# Altium schematic sheet VCA.SchDoc
size A4
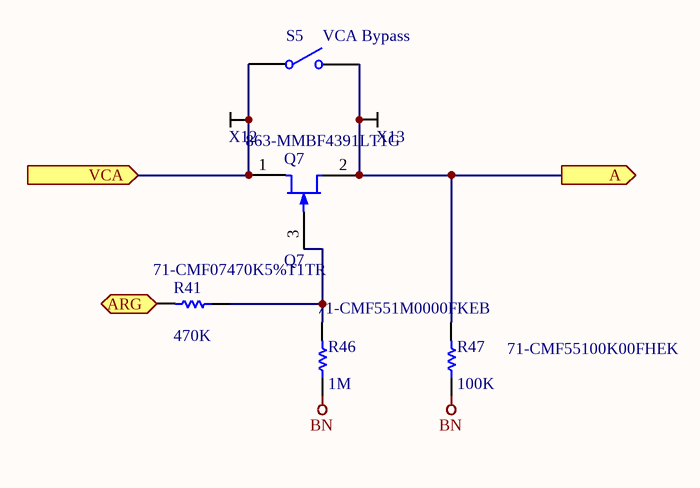
[diagram p0: VCA.SchDoc]

## Parts
Q7  Q7  Supplier Part Number 2: 863-MMBF4391LT1G  [ONSC-SOT-23-3-318-08_V]
R41  Supplier Part Number 1: 71-CMF07470K5%T1TR  [AXIAL-0.3]  (hidden comment: 470K)
R46  Supplier Part Number 1: 71-CMF551M0000FKEB  [AXIAL-0.3]  (hidden comment: 1M)
R47  Supplier Part Number 1: 71-CMF55100K00FHEK  [AXIAL-0.3]  (hidden comment: 100K)
S5  VCA Bypass  [SPST-2]
X12  X12  [Pad]  (value not drawn)
X13  X13  [Pad]  (value not drawn)

## Ports
A (out), ARG (out), VCA (in)

## Nets
BN: R46.1 R47.1
A: Q7.2(S) R47.2 S5.2(NO) X13.1 ; port A
ARG: R41.2 ; port ARG
VCA: Q7.1(D) S5.1(COMMON) X12.1 ; port VCA
NetQ7_3: Q7.3(G) R41.1 R46.2

## Library data of the parts
Q7 = MMBF4391LT1: JFET Switching Transistor, N-Channel, 3-Pin SOT-23, Tape and Reel; Manufacturer: On Semiconductor; Manufacturer Part Number: MMBF4391LT1G; Channel Polarity: N Channel; Ciss Max (pF): 14; Crss Max (pF): 3.5; IDSS Max (uA): 150000; IDSS Min (uA): 50000; V(BR)GSS Min (V): 30; Configuration: Single; Drain-Source Current at Vgs=0: 50 mA to 150 mA; Vds - Drain-Source Breakdown Voltage: 30 V; DatasheetVersion: Rev. 10; PackageVersion: Rev. AP, 11/2009; PackageReference: SOT-23-3-318-08; PackageDescription: 3-Pin Small Outline Transistor, Body 2.92 x 1.3 mm, Pitch 0.95 mm; Supplier 1: Mouser; Supplier Part Number 1: 863-MMBF4391LT1G; Packing: Tape and Reel; Mounting Technology: Surface Mount; PartNumber: MMBF4391LT1; ComponentLink1Description: Manufacturer URL; ComponentLink1URL: http://www.onsemi.com/; ComponentLink2Description: Datasheet; ComponentLink2URL: http://www.onsemi.com/pub_link/Collateral/MMBF4391LT1-D.PDF; ComponentLink3Description: Package Specification; ComponentLink3URL: http://www.onsemi.cn/pub_link/Collateral/318-08.PDF; Supplier 2: Mouser; RoHS: RoHS Compliant; Category: JFET; Stock 2: 3330; Pricing 2: 1=0.490, 10=0.339, 100=0.156, 1000=0.120, 3000=0.102, 9000=0.093, 24000=0.087, 45000=0.078, 99000=0.075 (USD); Package / Case: SOT-23-3; Packaging: Reel; Series: MMBF4391L; Brand: ON Semiconductor; Mounting Style: SMD/SMT; Transistor Polarity: N-Channel; Standard Pack Qty: 3000; Vgs - Gate-Source Breakdown Voltage: 30 V; RoHS - Mouser: Y; Minimum Order Quantity: 1; Reeling: True; ComponentLink4URL: http://www.mouser.com/ds/2/308/MMBF4391LT1-D-108578.pdf; ComponentLink4Description: http://www.mouser.com/ds/2/308/MMBF4391LT1-D-108578.pdf
R41 = Res1: Resistor; Manufacturer: Vishay / Dale; Manufacturer Part Number: CMF07470K00JKR6; Power Rating: 500 mW (1/2 W); Resistance: 470 kOhms; Temperature Coefficient: 100 PPM / C; Tolerance: 5 %; Voltage Rating: 250 V; Lead Diameter: 0.64 mm; Published: 8-Jun-2000; LatestRevisionDate: 17-Jul-2002; LatestRevisionNote: Re-released for DXP Platform.; PackageReference: AXIAL-0.3; Publisher: Altium Limited; PackageDescription: Axial Device, Thru-Hole; 2 Leads; 0.3 in Pin Spacing; Value: 470K; Supplier 1: Mouser; RoHS: No; Category: Metal Film Resistors - Through Hole; Stock 1: 1018; Pricing 1: 1=0.160, 1000=0.160, 2000=0.085, 4000=0.078, 10000=0.072, 20000=0.066 (USD); Diameter: 2.29 mm; Length: 6.1 mm; Operating Temperature Range: - 55 C to + 175 C; Packaging: Reel; Product: Metal Film Resistors Controlled Temp Coefficient; Series: CMF Industrial; Termination Style: Axial; Type: Metal Film Resistors, Industrial, Precision; Brand: Vishay / Dale; Standard Pack Qty: 1000; RoHS - Mouser: N; Minimum Order Quantity: 1; Reeling: True; ComponentLink1URL: http://www.mouser.com/ds/2/427/cmfind-239942.pdf; ComponentLink1Description: http://www.mouser.com/ds/2/427/cmfind-239942.pdf
R46 = Res1: Resistor; Manufacturer: Vishay / Dale; Manufacturer Part Number: CMF551M0000FKEB; Power Rating: 500 mW (1/2 W); Resistance: 1 MOhms; Temperature Coefficient: 100 PPM / C; Tolerance: 1 %; Voltage Rating: 250 V; Lead Diameter: 0.64 mm; Published: 8-Jun-2000; LatestRevisionDate: 17-Jul-2002; LatestRevisionNote: Re-released for DXP Platform.; PackageReference: AXIAL-0.3; Publisher: Altium Limited; PackageDescription: Axial Device, Thru-Hole; 2 Leads; 0.3 in Pin Spacing; Value: 1M; Supplier 1: Mouser; RoHS: RoHS Compliant; Category: Metal Film Resistors - Through Hole; Stock 1: 2620; Pricing 1: 1=0.310, 50=0.232, 100=0.146, 500=0.125, 1000=0.087, 2000=0.081, 5000=0.073, 10000=0.072, 25000=0.069 (USD); Diameter: 2.29 mm; Length: 6.1 mm; Operating Temperature Range: - 55 C to + 175 C; Packaging: Reel; Product: Metal Film Resistors Controlled Temp Coefficient; Series: CMF Industrial; Termination Style: Axial; Type: Metal Film Resistors, Industrial, Precision; Brand: Vishay / Dale; Standard Pack Qty: 1000; RoHS - Mouser: Y; Minimum Order Quantity: 1; Reeling: True; ComponentLink1URL: http://www.mouser.com/ds/2/427/cmfind-239942.pdf; ComponentLink1Description: http://www.mouser.com/ds/2/427/cmfind-239942.pdf
R47 = Res1: Resistor; Manufacturer: Vishay / Dale; Manufacturer Part Number: CMF55100K00FHEK; Power Rating: 500 mW (1/2 W); Resistance: 100 kOhms; Temperature Coefficient: 50 PPM / C; Tolerance: 1 %; Voltage Rating: 250 V; Lead Diameter: 0.64 mm; Published: 8-Jun-2000; LatestRevisionDate: 17-Jul-2002; LatestRevisionNote: Re-released for DXP Platform.; PackageReference: AXIAL-0.3; Publisher: Altium Limited; PackageDescription: Axial Device, Thru-Hole; 2 Leads; 0.3 in Pin Spacing; Value: 100K; Supplier 1: Mouser; RoHS: RoHS Compliant; Category: Metal Film Resistors - Through Hole; Stock 1: 4041; Pricing 1: 1=0.230, 25=0.181, 100=0.132, 500=0.115, 1000=0.099, 2000=0.092, 5000=0.087, 10000=0.082, 25000=0.072 (USD); Diameter: 2.29 mm; Length: 6.1 mm; Operating Temperature Range: - 55 C to + 175 C; Packaging: Bulk; Product: Metal Film Resistors Controlled Temp Coefficient; Series: CMF Industrial; Termination Style: Axial; Type: Metal Film Resistors, Industrial, Precision; Brand: Vishay / Dale; Standard Pack Qty: 100; RoHS - Mouser: Y; Minimum Order Quantity: 1; Reeling: False; ComponentLink1URL: http://www.mouser.com/ds/2/427/cmfind-239942.pdf; ComponentLink1Description: http://www.mouser.com/ds/2/427/cmfind-239942.pdf; Supplier Part Number 2: 71-CMF55100K00BEEB
S5 = SW-SPST: Single-Pole, Single-Throw Switch; Published: 24-Mar-1999; LatestRevisionDate: 17-Jul-2002; LatestRevisionNote: Re-released for DXP Platform.; PackageReference: SPST-2; Publisher: Altium Limited; PackageDescription: Switch; 2 Leads; Supplier 1: Mouser; Supplier Part Number 1: 108-MS550K
X12 X13 = Pad